# EAGLE design Arduino DUE shield Design (EAGLE 8.5.0)
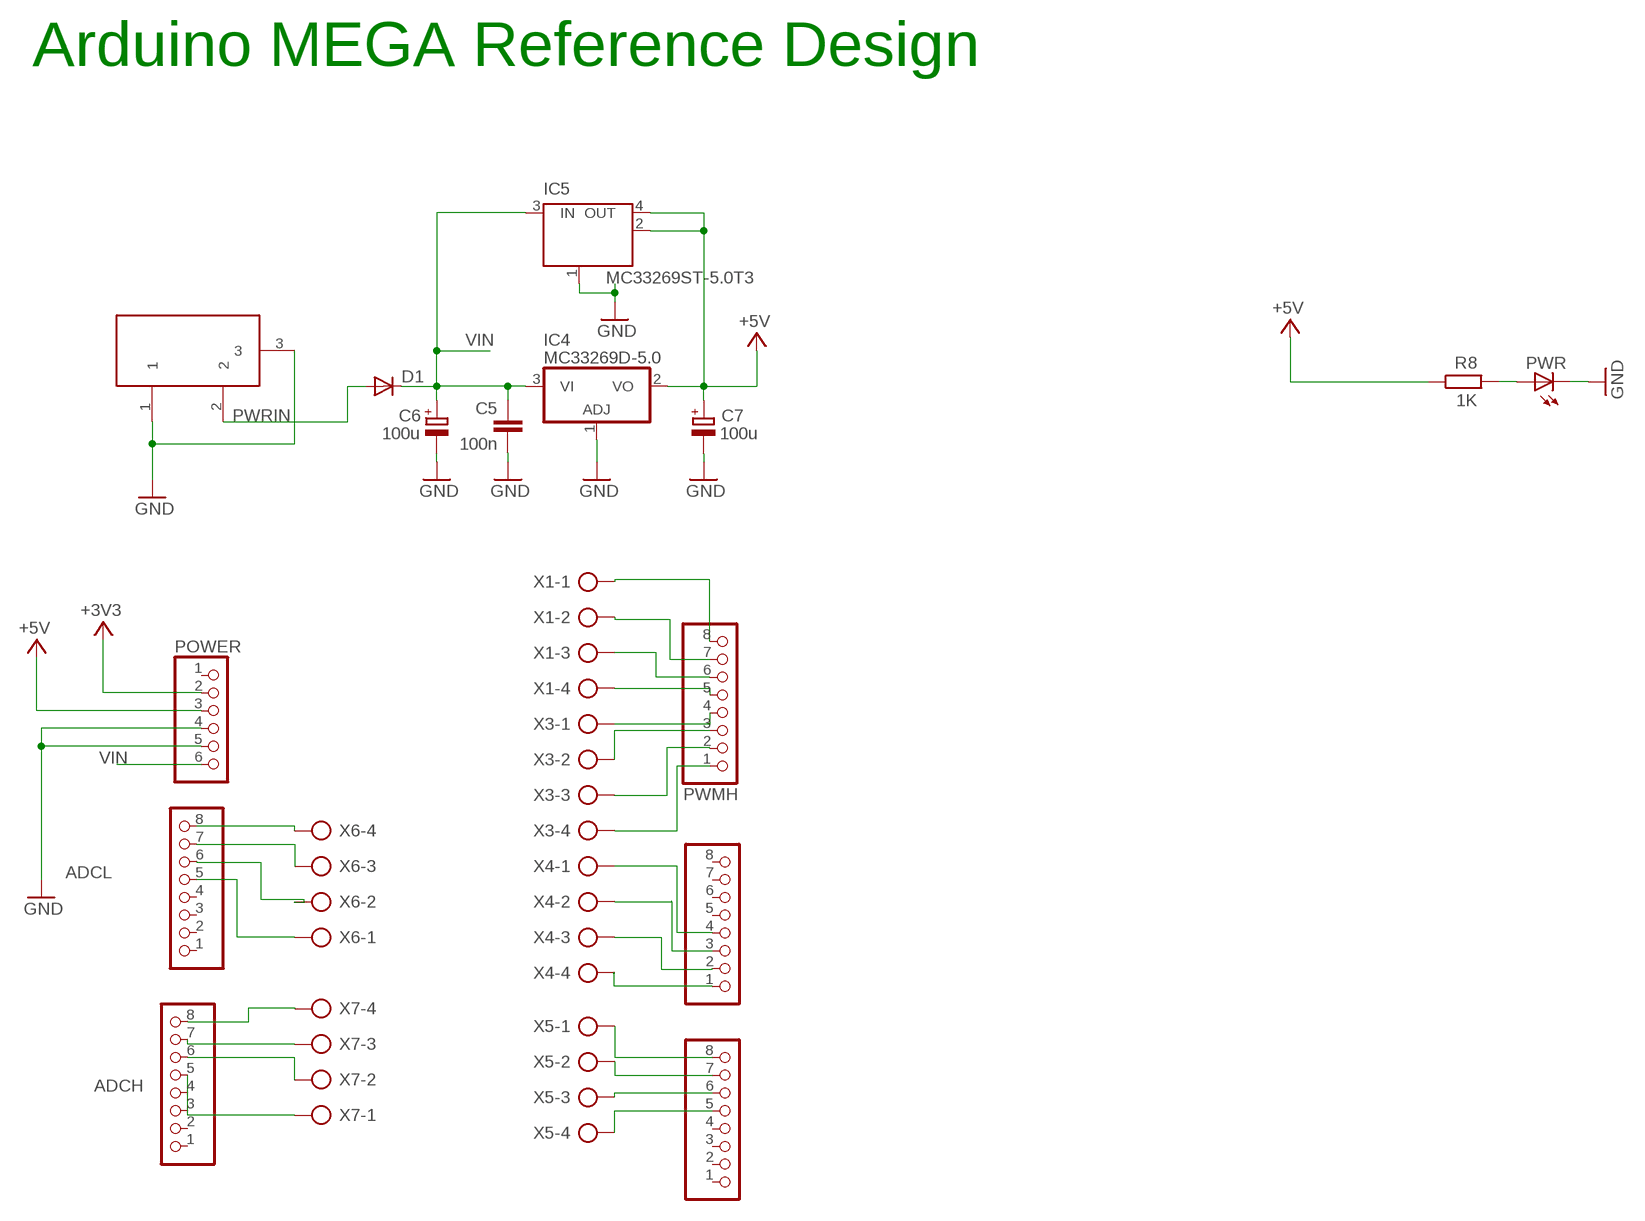
[diagram p0: schematic, sheet 1]

## Parts
ADCH  PINHD-1X8  [1X08]
ADCL  PINHD-1X8  [1X08]
C5  100n  C-EU  [C0805RND]
C6  100u  CPOL-EUSMCD  [SMC_D]
C7  100u  CPOL-EUSMCD  [SMC_D]
COMMUNICATION  PINHD-1X8  [1X08]
D1  DIODE-SMB  [SMB]
IC4  MC33269D-5.0  [DPACK]
IC5  MC33269ST-5.0T3  MC33269ST-3.3T3  [SOT223]
POWER  PINHD-1X6  [1X06]
PWMH  PINHD-1X8  [1X08]
PWML  PINHD-1X8  [1X08]
PWR  LED0805ROUND  [0805RND]
R8  1K  R-EU_  [R0805RND]
X1  AK500/4  [AK500/4]
X2  DC21MMX  [DC-21MM]
X3  AK500/4  [AK500/4]
X4  AK500/4  [AK500/4]
X5  AK500/4  [AK500/4]
X6  AK500/4  [AK500/4]
X7  AK500/4  [AK500/4]

## Nets
+3V3 [power]: POWER.2
+5V [usbvcc]: C7.+ IC4.2(VO) IC5.2(OUT) IC5.4(OUT) POWER.3 R8.1
GND [gnd]: C5.2 C6.- C7.- IC4.1(ADJ) IC5.1(GND/ADJ) POWER.4 POWER.5 PWR.P$2(C) X2.1 X2.3
N$1: ADCL.8 X6.4
N$2: ADCL.7 X6.3
N$3: PWR.P$1(A) R8.2
N$4: ADCL.6 X6.2
N$5: ADCL.5 X6.1
N$6: ADCH.8 X7.4
N$7: ADCH.7 X7.3
N$8: ADCH.6 X7.2
N$9: ADCH.5 X7.1
N$10: COMMUNICATION.8 X5.1
N$11: COMMUNICATION.7 X5.2
N$12: COMMUNICATION.6 X5.3
N$13: COMMUNICATION.5 X5.4
N$14: PWML.1 X4.4
N$15: PWML.2 X4.3
N$16: PWML.3 X4.2
N$17: PWML.4 X4.1
N$18: PWMH.1 X3.4
N$19: PWMH.2 X3.3
N$20: PWMH.3 X3.2
N$21: PWMH.4 X3.1
N$22: PWMH.5 X1.4
N$23: PWMH.6 X1.3
N$24: PWMH.7 X1.2
N$25: PWMH.8 X1.1
PWRIN [power]: D1.A X2.2
VIN [power]: C5.1 C6.+ D1.C IC4.3(VI) IC5.3(IN) POWER.6
Unconnected: ADCH.1 ADCH.2 ADCH.3 ADCH.4 ADCL.1 ADCL.2 ADCL.3 ADCL.4 COMMUNICATION.1 COMMUNICATION.2 COMMUNICATION.3 COMMUNICATION.4 POWER.1 PWML.5 PWML.6 PWML.7 PWML.8

## Notes on the sheet
- Arduino MEGA Reference Design

## Library data of the parts
ADCH ADCL COMMUNICATION PWMH PWML = pinhead:PINHD-1X8: PIN HEADER
C5 = rcl:C-EU: CAPACITOR, European symbol
C6 C7 = rcl:CPOL-EU: POLARIZED CAPACITOR, European symbol
D1 = diode:DIODE-: DIODE
IC4 = linear:MC33269?*: Adjustable Output Low Dropout Voltage Regulator 800 mA Source: http://www.onsemi.com/pub/Collateral/MC33269-D.PDF
IC5 = linear:MC33269ST*: Adjustable Output Low Dropout Voltage Regulator 800 mA Source: http://www.onsemi.com/pub/Collateral/MC33269-D.PDF
POWER = pinhead:PINHD-1X6: PIN HEADER
PWR = led:LED: LED OSRAM: - CHIPLED LG R971, LG N971, LY N971, LG Q971, LY Q971, LO R971, LY R971 LH N974, LH R974 LS Q976, LO Q976, LY Q976 LO Q996 - Hyper CHIPLED LW Q18S LB Q993, LB Q99A, LB R99A - SideLED LS A670, LO A670, LY A670, LG A670, LP A670 LB A673, LV A673, LT A673, LW A673 LH A674 LY A675 LS A676, LA A676, LO A676, LY A676, LW A676 LS A679, LY A679, LG A679 - Hyper Micro SIDELED® LS Y876, LA Y876, LO Y876, LY Y876 LT Y87S - SmartLED LW L88C, LW L88S LB L89C, LB L89S, LG L890 LS L89K, LO L89K, LY L89K LS L896, LA L896, LO L896, LY L896 - TOPLED LS T670, LO T670, LY T670, LG T670, LP T670 LSG T670, LSP T670, LSY T670, LOP T670, LYG T670 LG T671, LOG T671, LSG T671 LB T673, LV T673, LT T673, LW T673 LH T674 LS T676, LA T676, LO T676, LY T676, LB T676, LH T676, LSB T676, LW T676 LB T67C, LV T67C, LT T67C, LS T67K, LO T67K, LY T67K, LW E67C LS E67B, LA E67B, LO E67B, LY E67B, LB E67C, LV E67C, LT E67C LW T67C LS T679, LY T679, LG T679 LS T770, LO T770, LY T770, LG T770, LP T770 LB T773, LV T773, LT T773, LW T773 LH T774 LS E675, LA E675, LY E675, LS T675 LS T776, LA T776, LO T776, LY T776, LB T776 LHGB T686 LT T68C, LB T68C - Hyper Mini TOPLED® LB M676 - Mini TOPLED Santana® LG M470 LS M47K, LO M47K, LY M47K Source: http://www.osram.convergy.de/
R8 = rcl:R-EU_: RESISTOR, European symbol
X1 X3-X7 = con-ptr500:AK500/4: CONNECTOR; OC_FARNELL: unknown; OC_NEWARK: unknown
X2 = powersupply:DC21MM

## Net classes
0 default: width 0.203 mm, drill 0.406 mm, clearance 0.203 mm
1 power: width 0.61 mm, drill 0.711 mm, clearance 0.203 mm
2 gnd: width 0.305 mm, drill 0.711 mm, clearance 0.203 mm
3 usbvcc: width 0.508 mm, drill 0.711 mm, clearance 0.203 mm

## Board
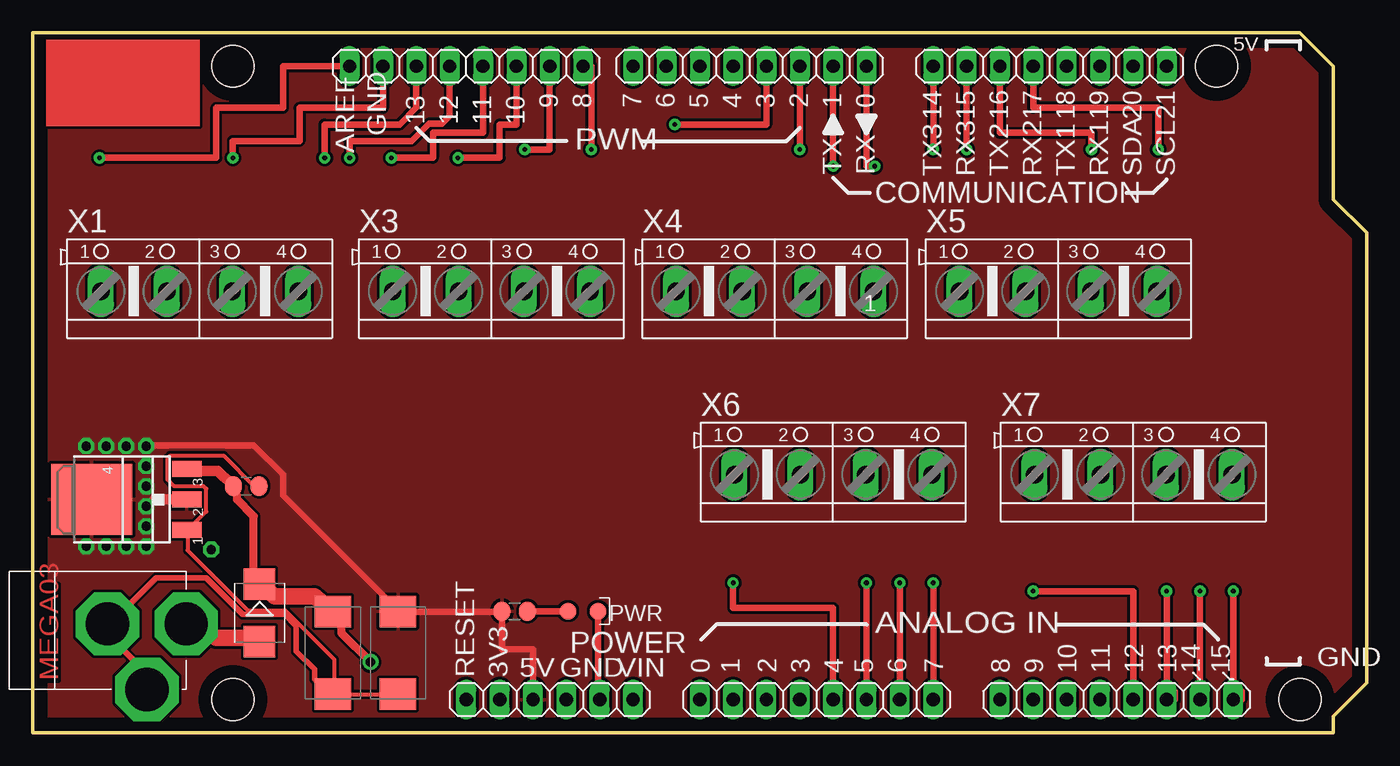
[diagram p1: board, top side]
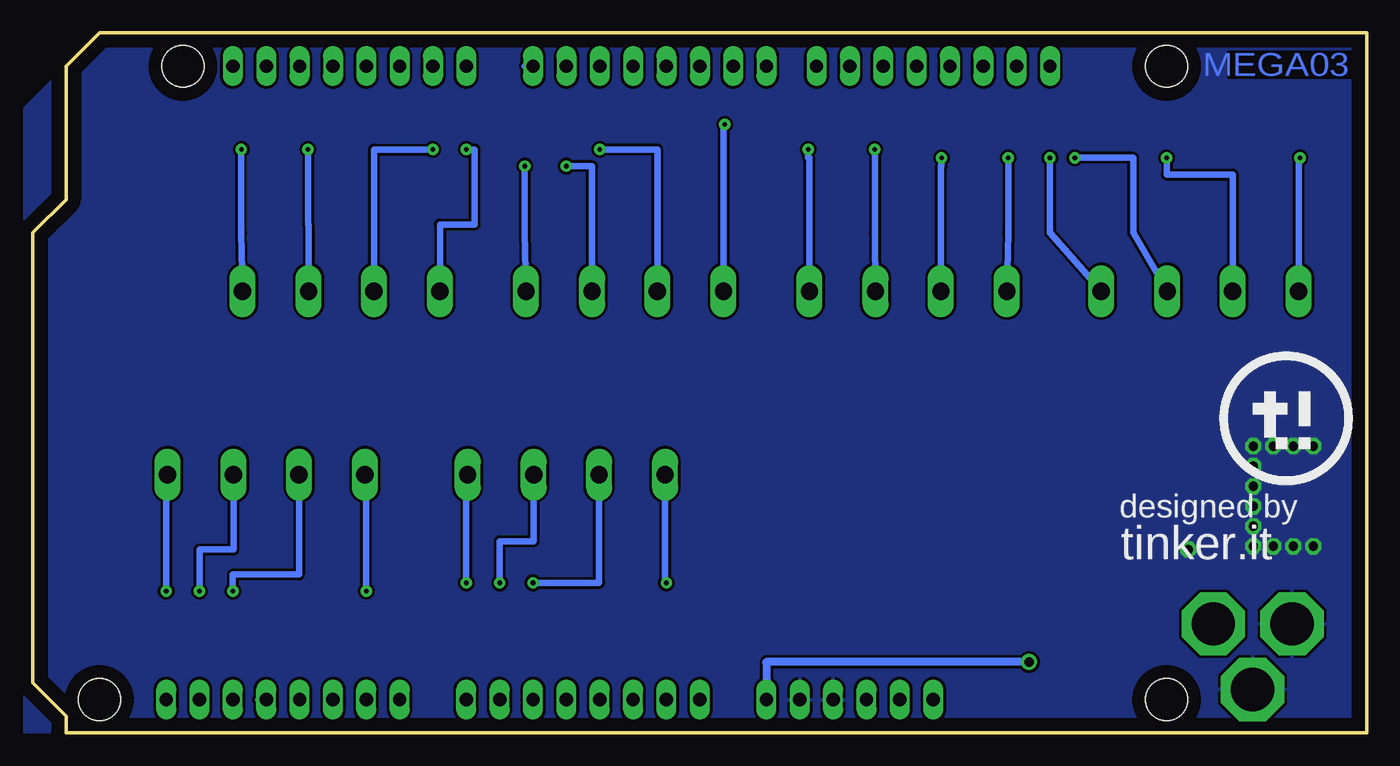
[diagram p2: board, bottom side, seen from below]

Size 101.6 x 53.34 mm. Coordinates in mm from the lower left corner, seen from the top.
Outline: 0,53.34 96.52,53.34 99.06,50.8 99.06,40.64 101.6,38.1 101.6,3.81 99.06,1.27 99.06,0 0,0 0,53.34
Copper layers (1*16): Top 0.035mm / dielectric 1.5mm / Bottom 0.035mm
Design rules "default *": minimum track width 8mil, minimum drill 16mil, track to track 8mil, track to pad 8mil, pad to pad 8mil, via to via 10mil, smd to smd 8mil, copper to edge 40mil, drill to drill 12mil, minimum pad ring 10mil, minimum via ring 10mil, stop-mask expansion 4mil, vias tented up to drill 0mil, thermal gap 10mil
Holes 3.2 mm at 96.52,2.54 15.24,50.8 90.17,50.8 15.24,2.54

### Footprints (pad centres in the part's own frame; a part is rotated, then mirrored left to right if it is on the bottom)
1X08 = drill 1.016 long: 1 -8.89,0; 2 -6.35,0; 3 -3.81,0; 4 -1.27,0; 5 1.27,0; 6 3.81,0; 7 6.35,0; 8 8.89,0
C0805RND = smd 1.3 x 1.5: 1 -0.977,0; 2 0.977,0
SMC_D = smd 2.4 x 2.8: + -3.15,0; - 3.15,0
SMB = smd 2.4 x 2.4: A 2.2,0; C -2.2,0
DPACK = smd 1 x 1.6: 1 -2.28,-4.8; 3 2.28,-4.8 | smd 5.4 x 6.2: 2 0,2.5
SOT223 = smd 1.219 x 2.235: 1 -2.311,-3.099; 2 0,-3.099; 3 2.311,-3.099 | smd 3.6 x 2.2: 4 0,3.099
1X06 = drill 1.016 long: 1 -6.35,0; 2 -3.81,0; 3 -1.27,0; 4 1.27,0; 5 3.81,0; 6 6.35,0
0805RND = smd 1.27 x 1.27: P$1 -1.143,0; P$2 1.143,0
R0805RND = smd 1.3 x 1.5: 1 -0.977,0; 2 0.977,0
AK500/4 = drill 1.321 long: 1 -7.518,0; 2 -2.489,0; 3 2.489,0; 4 7.518,0
DC-21MM = drill 3.302 pad 4.826 octagon: 1 -5.08,-3.353; 2 -0.076,-6.35; 3 -0.076,-0.356

### Placement (x,y rotation side)
ADCH  82.55,2.54 0 top
ADCL  59.69,2.54 0 top
C5  16.26,18.8 0 top
C6  22.86,6.1 270 top
C7  27.81,6.1 270 top
COMMUNICATION  77.47,50.8 180 top
D1  17.27,9.14 270 top
IC4  6.99,17.78 90 top
IC5  8.64,17.78 90 top
POWER  39.37,2.54 0 top
PWMH  33.02,50.8 180 top
PWML  54.61,50.8 180 top
PWR  41.91,9.27 0 top
R8  36.7,9.27 0 top
X1  12.7,33.66 0 top
X2  5.33,8.38 90 top
X3  34.92,33.66 0 top
X4  56.52,33.66 0 top
X5  78.11,33.66 0 top
X6  60.96,19.68 0 top
X7  83.82,19.68 0 top

### Tracks (layer width: path | path; a pad name or v marks a point on that pad's centre or on a via)
+5V  (via drill 0.71)
  Top 0.508: POWER.3 38.1,6.35 35.73,6.35 R8.1 35.56,9.21 27.94,9.21 C7.+ 27.62,9.53 19.05,18.1 19.05,19.68 16.83,21.91 8.89,21.91 v8.64,21.84
  Top 0.813: 9.27,17.78 IC5.2
  other vias: 4.06,21.84 7.11,21.84 5.59,21.84 8.64,20.32 8.64,18.8 4.06,14.22 5.59,14.22 7.11,14.22 8.64,15.75 8.64,17.27 8.64,14.22
  pour Top (isolate 0.305, hatched): 8.51,13.46 9.27,14.22 9.27,22.23 8.13,23.37 3.56,23.37 2.16,21.97 2.16,14.73 3.43,13.46
  pour Bottom: 2.16,14.73 2.16,21.97 3.56,23.37 8.64,23.5 11.05,21.08 11.05,14.73 9.53,13.34 3.56,13.34
  pour Top: 0,53.34 0,0 102.23,0 102.23,47.62 96.52,53.34
GND  (via drill 0.71)
  Top 0.305: IC4.1 11.81,15.49 IC5.1 | C7.- 27.74,2.95 23.06,2.95 C6.- 22.96,3.05 22.96,5.59 19.2,9.35 16.36,9.35 11.79,13.92 11.79,15.34 IC4.1 | C5.2 16.87,18.8 14.53,21.13 10.46,21.13 10.26,20.93 10.26,19.3 10.77,18.8 13.01,18.8 13.21,18.59 13.21,16.87 11.89,15.54 IC4.1
  Top 0.406: C6.- 21.46,4.06 21.46,4.83 20.07,6.22 20.07,8.13 19.18,9.02 16,9.02 13.21,11.81 9.4,11.81 5.84,8.26 5.79,8.31 X2.3 6.99,6.22 7.62,5.59 X2.1
  Top 0.508: PWR.P$2 43.05,2.54 POWER.5
  other vias: 13.59,13.97
  pour Bottom: 102.23,0 0,0 0,53.34 102.23,53.34
N$1  (via drill 0.35)
  Top 0.508: v68.58,11.43 ADCL.8
  Bottom 0.508: X6.4 68.58,19.68 v68.58,11.43
N$2  (via drill 0.35)
  Top 0.508: v66.04,11.43 ADCL.7
  Bottom 0.508: X6.3 63.45,14.61 66.04,14.61 v66.04,11.43
N$3
  Top 0.508: PWR.P$1 R8.2
N$4  (via drill 0.35)
  Top 0.508: ADCL.6 v63.5,11.43
  Bottom 0.508: v63.5,11.43 58.47,11.43 X6.2
N$5  (via drill 0.35)
  Top 0.508: v53.34,11.43 53.34,9.53 60.96,9.53 ADCL.5
  Bottom 0.508: X6.1 53.44,11.43 v53.34,11.43
N$6  (via drill 0.35)
  Top 0.508: v91.44,10.79 91.44,3.17 92.08,3.17 92.08,2.54 ADCH.8
  Bottom 0.508: X7.4 91.44,19.68 v91.44,10.79
N$7  (via drill 0.35)
  Top 0.508: ADCH.7 v88.9,10.79
  Bottom 0.508: v88.9,10.79 88.9,13.97 86.31,13.97 X7.3
N$8  (via drill 0.35)
  Top 0.508: v86.36,10.79 86.36,3.17 87,3.17 87,2.54 ADCH.6
  Bottom 0.508: ADCH.6 86.36,3.17 | X7.2 81.33,12.06 86.36,12.06 v86.36,10.79
N$9  (via drill 0.35)
  Top 0.508: ADCH.5 83.82,10.79 v76.2,10.79
  Bottom 0.508: 84.45,2.54 ADCH.5 | v76.2,10.79 76.2,19.68 X7.1
N$10  (via drill 0.35)
  Top 0.508: v68.58,44.45 COMMUNICATION.8
  Bottom 0.508: X5.1 70.59,38.73 67.94,38.73 67.94,44.45 v68.58,44.45
N$11  (via drill 0.35)
  Top 0.508: v71.12,44.45 COMMUNICATION.7
  Bottom 0.508: X5.2 75.62,44.45 v71.12,44.45
N$12  (via drill 0.35)
  Top 0.508: v80.64,44.45 80.64,45.72 73.66,45.72 COMMUNICATION.6
  Bottom 0.508: v80.64,44.45 80.64,38.73 80.59,38.73 X5.3
N$13  (via drill 0.35)
  Top 0.508: COMMUNICATION.5 76.2,47.62 85.72,47.62 v85.72,44.45
  Bottom 0.508: X5.4 85.72,38.1 v85.72,44.45
N$14  (via drill 0.35)
  Top 0.508: PWML.1 63.5,43.18 v64.14,43.18
  Bottom 0.508: 63.5,50.16 PWML.1 64.14,50.8 | v64.14,43.18 64.14,38.1 X4.4
N$15  (via drill 0.35)
  Top 0.508: PWML.2 v60.96,43.18
  Bottom 0.508: X4.3 59,43.18 v60.96,43.18
N$16  (via drill 0.35)
  Top 0.508: v58.42,44.45 PWML.3
  Bottom 0.508: X4.2 54.03,44.45 v58.42,44.45
N$17  (via drill 0.35)
  Top 0.508: PWML.4 55.88,46.35 v48.9,46.35
  Bottom 0.508: v48.9,46.35 49,46.35 X4.1
N$18  (via drill 0.35)
  Top 0.508: v42.55,44.45 42.55,50.8 PWMH.1
  Bottom 0.508: X3.4 42.44,43.81 42.55,43.81 v42.55,44.45
N$19  (via drill 0.35)
  Top 0.508: PWMH.2 39.37,44.45 v37.47,44.45
  Bottom 0.508: v37.47,44.45 37.47,38.1 X3.3
N$20  (via drill 0.35)
  Top 0.508: v32.38,43.81 35.56,43.81 35.56,46.35 36.83,46.35 PWMH.3
  Bottom 0.508: X3.2 32.44,43.18 32.38,43.18 v32.38,43.81
N$21  (via drill 0.35)
  Top 0.508: PWMH.4 34.29,45.72 30.48,45.72 30.48,43.81 v27.3,43.81
  Bottom 0.508: v27.3,43.81 27.3,38.1 X3.1
N$22  (via drill 0.35)
  Top 0.508: PWMH.5 31.75,46.99 31.19,46.43 30.18,46.43 28.84,45.09 24.13,45.09 v24.13,43.81
  Bottom 0.508: v24.13,43.81 24.13,38.1 X1.4
N$23  (via drill 0.35)
  Top 0.508: v22.23,43.81 22.23,46.35 27.94,46.35 29.21,47.62 PWMH.6
  Bottom 0.508: X1.3 17.78,38.1 17.78,43.81 v22.23,43.81
N$24  (via drill 0.35)
  Top 0.508: PWMH.7 26.67,47.62 20.32,47.62 20.32,45.09 15.24,45.09 v15.24,43.81
  Bottom 0.508: v15.24,43.81 15.24,42.55 10.21,42.55 X1.2
N$25  (via drill 0.35)
  Top 0.508: v5.08,43.81 13.97,43.81 13.97,47.62 19.05,47.62 19.05,50.8 PWMH.8
  Bottom 0.508: X1.1 5.18,43.81 v5.08,43.81
N$26
  pour Bottom: 0,53.34 0,0 102.23,0 102.23,47.62 96.52,53.34
PWRIN
  Top 1.27: D1.A 16.13,7.24 13.97,7.24 X2.2
VIN  (via drill 0.71)
  Top 0.61: 11.81,20.07 IC4.3 | 15.24,18.8 15.11,19.05 | v25.72,5.4 23.5,7.62 23.5,9.21 C6.+ | C5.1 15.24,18.41 15.56,18.1 15.56,17.78 16.83,16.51 16.83,11.75 D1.C
  Top 0.813: 11.81,20.07 IC5.3 12.19,20.19 12.57,19.94 14.07,19.94 14.45,19.56 15.11,19.05 | C5.1 15.24,18.8
  Top 1.27: D1.C 18.41,10.41 21.46,10.41 C6.+
  Bottom 0.61: POWER.6 45.72,5.4 v25.72,5.4
(copper drawn outside any net)
  shapes: Top area x1

### Text on the board
Top: MEGA03
Bottom: MEGA03
tPlace: 9 | 8 | 7 | 6 | 5 | 4 | 3 | 2 | 1 | 0 | 14 | 15 | 16 | 17 | 18 | 19 | 20 | 21 | 13 | 12 | 11 | 10 | 0 | 1 | 2 | 3 | 4 | 5 | 6 | 7 | 8 | 9 | 10 | 11 | 12 | 13 | 14 | 15
tNames: 5V | GND | AREF | PWM | TX | RX | TX3 | RX3 | TX2 | RX2 | TX1 | RX1 | SDA | SCL | 1 | ANALOG IN | GND | RESET | 3V3 | 5V | GND | VIN
bNames: designed by | tinker.it
Reference: C7 | C6